# Altium schematic sheet VALVEBOARD_Controller.SchDoc
size A3; SheetNumber: 2; SheetTotal: 9
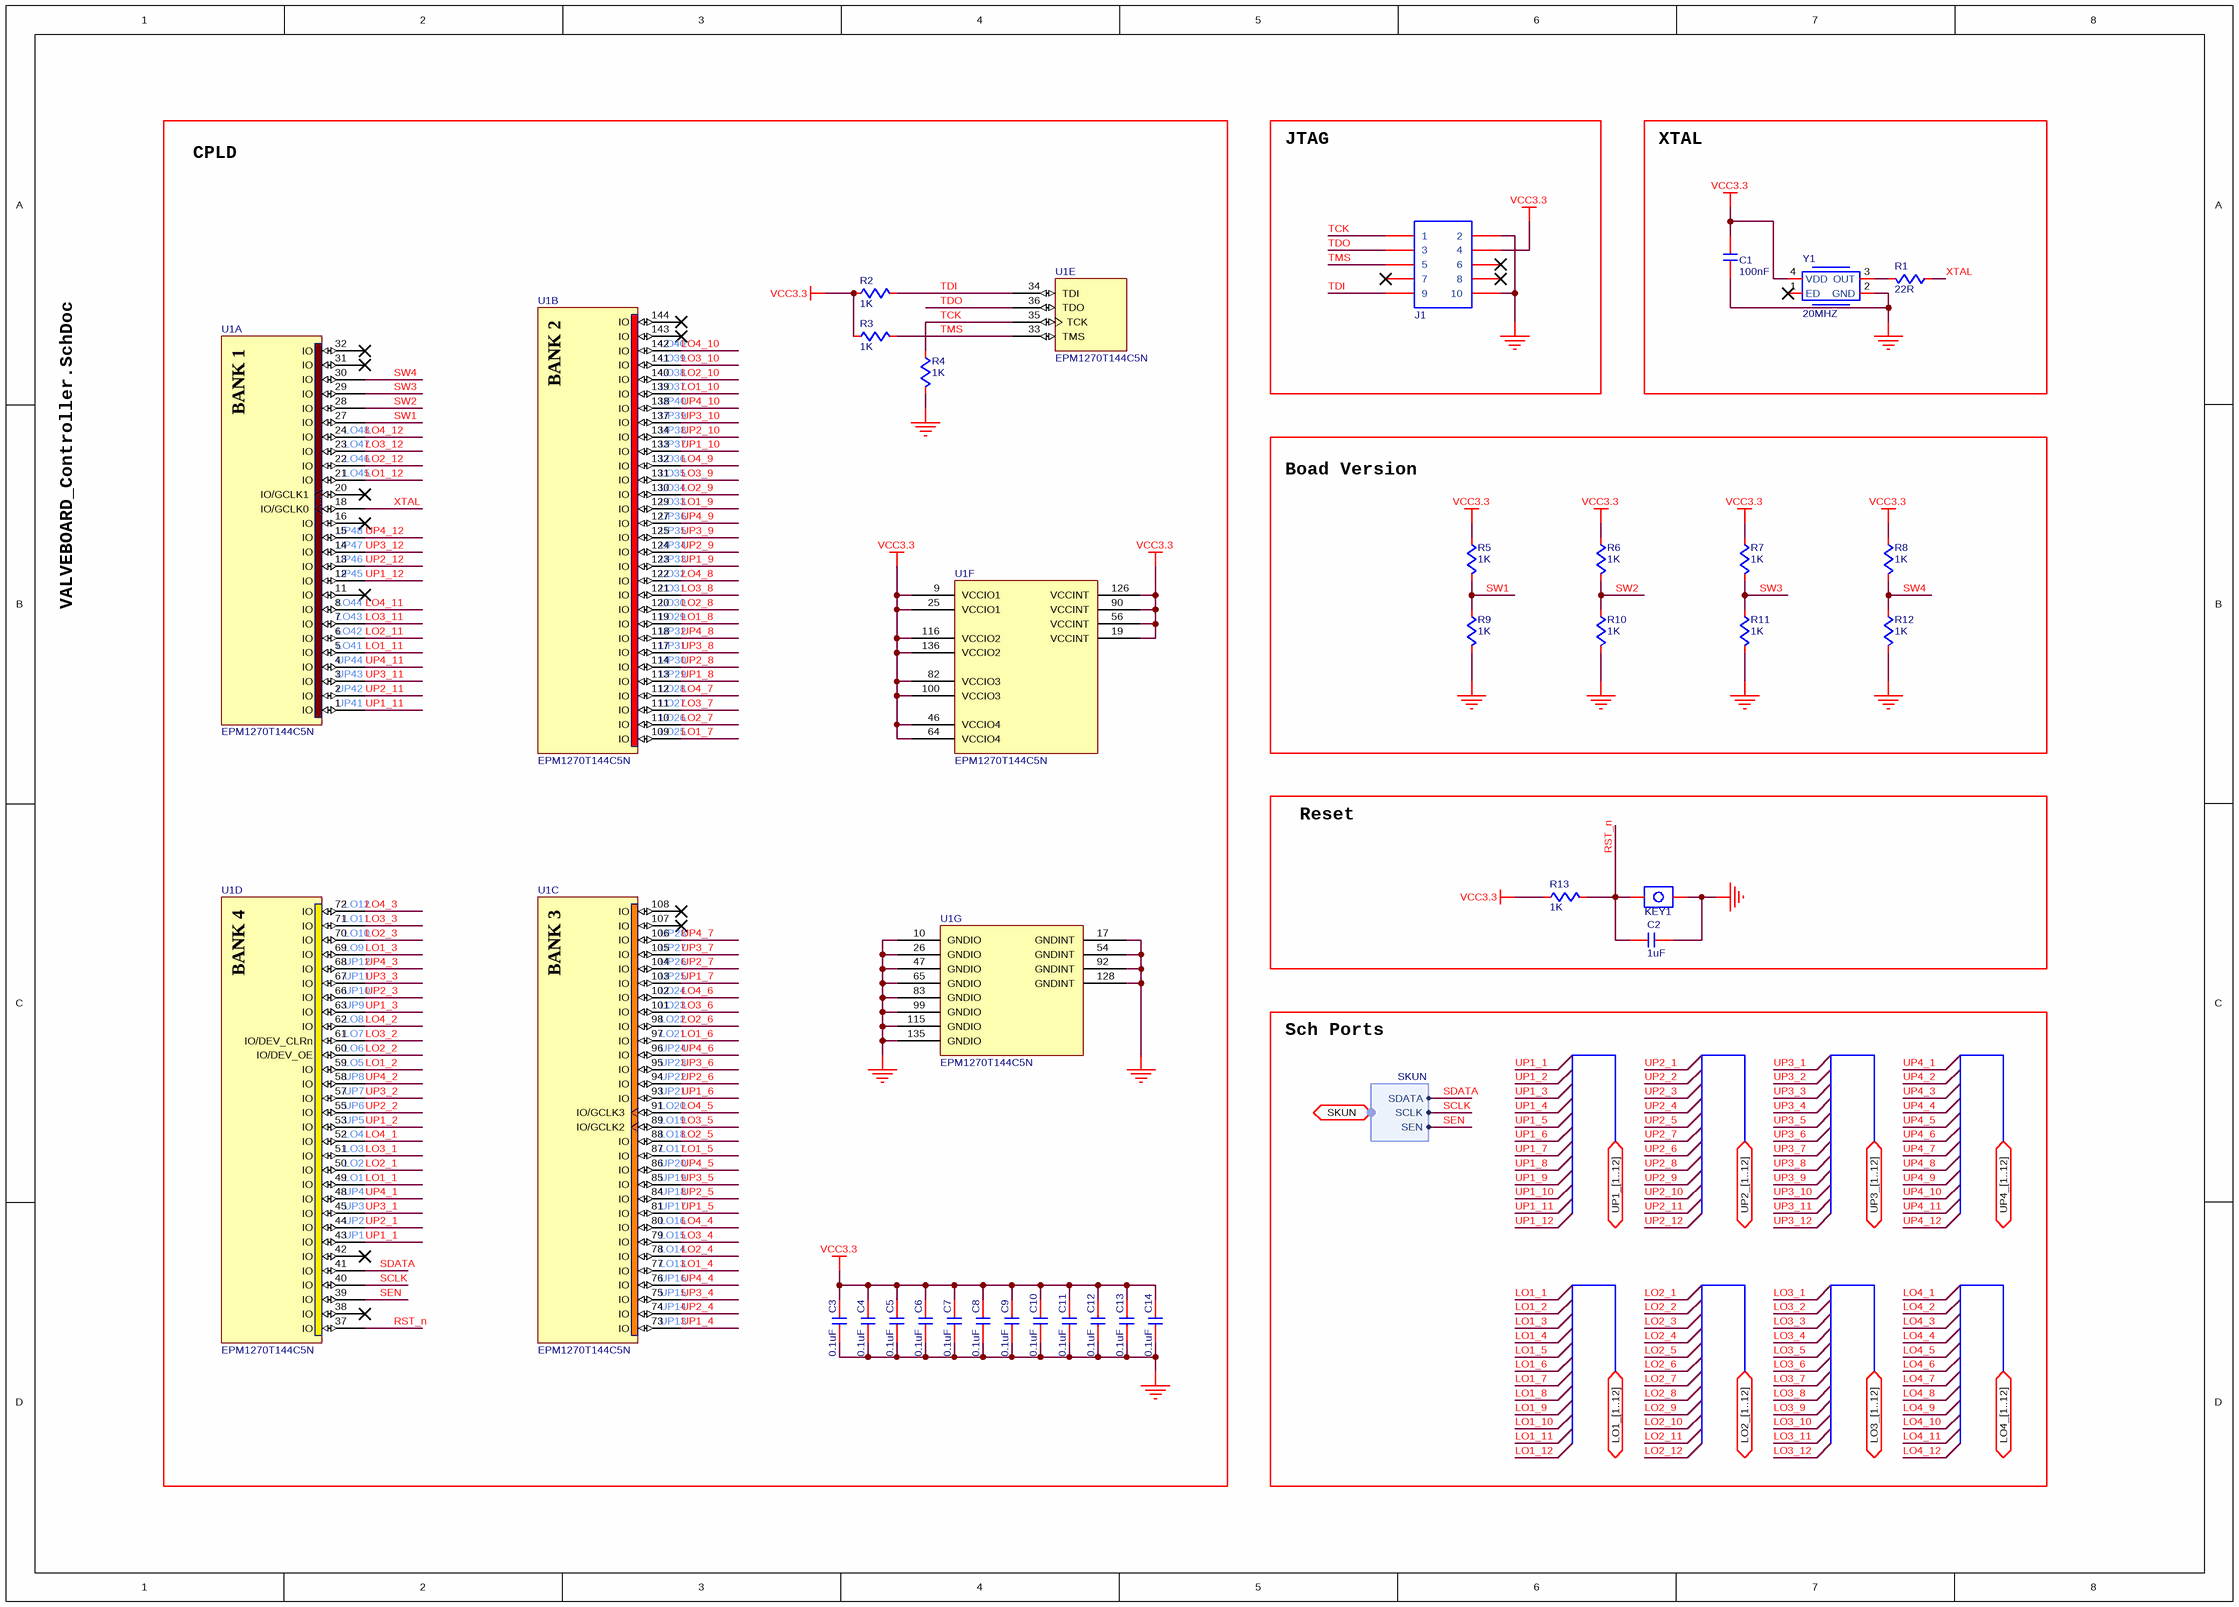
[diagram p0: VALVEBOARD_Controller.SchDoc]

## Parts
C1  value 100nF  [C0402]  (hidden comment: C-NOMO)
C2  value 1uF  [C0402]  (hidden comment: C-NOMO)
C3  value 0.1uF  [C0402]  (hidden comment: C-NOMO)
C4  value 0.1uF  [C0402]  (hidden comment: C-NOMO)
C5  value 0.1uF  [C0402]  (hidden comment: C-NOMO)
C6  value 0.1uF  [C0402]  (hidden comment: C-NOMO)
C7  value 0.1uF  [C0402]  (hidden comment: C-NOMO)
C8  value 0.1uF  [C0402]  (hidden comment: C-NOMO)
C9  value 0.1uF  [C0402]  (hidden comment: C-NOMO)
C10  value 0.1uF  [C0402]  (hidden comment: C-NOMO)
C11  value 0.1uF  [C0402]  (hidden comment: C-NOMO)
C12  value 0.1uF  [C0402]  (hidden comment: C-NOMO)
C13  value 0.1uF  [C0402]  (hidden comment: C-NOMO)
C14  value 0.1uF  [C0402]  (hidden comment: C-NOMO)
J1  HDR2X5  [HDR2X5-NJ]  (value not drawn)
KEY1  KEY  [KEY735SO]  (value not drawn)
R1  value 22R  [R0402]  (hidden comment: R)
R2  value 1K  [R0402]  (hidden comment: R)
R3  value 1K  [R0402]  (hidden comment: R)
R4  value 1K  [R0402]  (hidden comment: R)
R5  value 1K  [R0402]  (hidden comment: R)
R6  value 1K  [R0402]  (hidden comment: R)
R7  value 1K  [R0402]  (hidden comment: R)
R8  value 1K  [R0402]  (hidden comment: R)
R9  value 1K  [R0402]  (hidden comment: R)
R10  value 1K  [R0402]  (hidden comment: R)
R11  value 1K  [R0402]  (hidden comment: R)
R12  value 1K  [R0402]  (hidden comment: R)
R13  value 1K  [R0402]  (hidden comment: R)
U1  EPM1270T144C5N  [TQFP144_N]  (parts A,B,C,D,E,F,G of 7)
Y1  frequency: 20MHZ  [OSC3225]  (hidden comment: XTAL)

## Blocks framed on the sheet
CPLD: C3-C14 R2-R4 U1
JTAG: J1
XTAL: C1 R1 Y1
Boad Version: R5-R12
Reset: C2 KEY1 R13

## Ports
LO1_[1..12] (bidir), LO2_[1..12] (bidir), LO3_[1..12] (bidir), LO4_[1..12] (bidir), SKUN (bidir, harness SKUN), UP1_[1..12] (bidir), UP2_[1..12] (bidir), UP3_[1..12] (bidir), UP4_[1..12] (bidir)

## Harnesses
SKUN: SDATA, SCLK, SEN

## Nets
DGND: C1.1 C2.1 C3.1 C4.1 C5.1 C6.1 C7.1 C8.1 C9.1 C10.1 C11.1 C12.1 C13.1 C14.1 J1.2 J1.10 KEY1.1 R4.1 R9.1 R10.1 R11.1 R12.1 U1.10(GNDIO) U1.17(GNDINT) U1.26(GNDIO) U1.47(GNDIO) U1.54(GNDINT) U1.65(GNDIO) U1.83(GNDIO) U1.92(GNDINT) U1.99(GNDIO) U1.115(GNDIO) U1.128(GNDINT) U1.135(GNDIO) Y1.2(GND)
VCC3.3: C1.2 C3.2 C4.2 C5.2 C6.2 C7.2 C8.2 C9.2 C10.2 C11.2 C12.2 C13.2 C14.2 J1.4 R2.2 R3.2 R5.2 R6.2 R7.2 R8.2 R13.2 U1.9(VCCIO1) U1.19(VCCINT) U1.25(VCCIO1) U1.46(VCCIO4) U1.56(VCCINT) U1.64(VCCIO4) U1.82(VCCIO3) U1.90(VCCINT) U1.100(VCCIO3) U1.116(VCCIO2) U1.126(VCCINT) U1.136(VCCIO2) Y1.4(VDD)
LO1_1: U1.49(IO)
LO1_2: U1.59(IO)
LO1_3: U1.69(IO)
LO1_4: U1.77(IO)
LO1_5: U1.87(IO)
LO1_6: U1.97(IO)
LO1_7: U1.109(IO)
LO1_8: U1.119(IO)
LO1_9: U1.129(IO)
LO1_10: U1.139(IO)
LO1_11: U1.5(IO)
LO1_12: U1.21(IO)
LO2_1: U1.50(IO)
LO2_2: U1.60(IO/DEV_OE)
LO2_3: U1.70(IO)
LO2_4: U1.78(IO)
LO2_5: U1.88(IO)
LO2_6: U1.98(IO)
LO2_7: U1.110(IO)
LO2_8: U1.120(IO)
LO2_9: U1.130(IO)
LO2_10: U1.140(IO)
LO2_11: U1.6(IO)
LO2_12: U1.22(IO)
LO3_1: U1.51(IO)
LO3_2: U1.61(IO/DEV_CLRn)
LO3_3: U1.71(IO)
LO3_4: U1.79(IO)
LO3_5: U1.89(IO/GCLK2)
LO3_6: U1.101(IO)
LO3_7: U1.111(IO)
LO3_8: U1.121(IO)
LO3_9: U1.131(IO)
LO3_10: U1.141(IO)
LO3_11: U1.7(IO)
LO3_12: U1.23(IO)
LO4_1: U1.52(IO)
LO4_2: U1.62(IO)
LO4_3: U1.72(IO)
LO4_4: U1.80(IO)
LO4_5: U1.91(IO/GCLK3)
LO4_6: U1.102(IO)
LO4_7: U1.112(IO)
LO4_8: U1.122(IO)
LO4_9: U1.132(IO)
LO4_10: U1.142(IO)
LO4_11: U1.8(IO)
LO4_12: U1.24(IO)
RST_n: C2.2 KEY1.2 R13.1 U1.37(IO)
SCLK: U1.40(IO) ; port SKUN.SCLK
SDATA: U1.41(IO) ; port SKUN.SDATA
SEN: U1.39(IO) ; port SKUN.SEN
SW1: R5.1 R9.2 U1.27(IO)
SW2: R6.1 R10.2 U1.28(IO)
SW3: R7.1 R11.2 U1.29(IO)
SW4: R8.1 R12.2 U1.30(IO)
TCK: J1.1 R4.2 U1.35(TCK)
TDI: J1.9 R2.1 U1.34(TDI)
TDO: J1.3 U1.36(TDO)
TMS: J1.5 R3.1 U1.33(TMS)
UP1_1: U1.43(IO)
UP1_2: U1.53(IO)
UP1_3: U1.63(IO)
UP1_4: U1.73(IO)
UP1_5: U1.81(IO)
UP1_6: U1.93(IO)
UP1_7: U1.103(IO)
UP1_8: U1.113(IO)
UP1_9: U1.123(IO)
UP1_10: U1.133(IO)
UP1_11: U1.1(IO)
UP1_12: U1.12(IO)
UP2_1: U1.44(IO)
UP2_2: U1.55(IO)
UP2_3: U1.66(IO)
UP2_4: U1.74(IO)
UP2_5: U1.84(IO)
UP2_6: U1.94(IO)
UP2_7: U1.104(IO)
UP2_8: U1.114(IO)
UP2_9: U1.124(IO)
UP2_10: U1.134(IO)
UP2_11: U1.2(IO)
UP2_12: U1.13(IO)
UP3_1: U1.45(IO)
UP3_2: U1.57(IO)
UP3_3: U1.67(IO)
UP3_4: U1.75(IO)
UP3_5: U1.85(IO)
UP3_6: U1.95(IO)
UP3_7: U1.105(IO)
UP3_8: U1.117(IO)
UP3_9: U1.125(IO)
UP3_10: U1.137(IO)
UP3_11: U1.3(IO)
UP3_12: U1.14(IO)
UP4_1: U1.48(IO)
UP4_2: U1.58(IO)
UP4_3: U1.68(IO)
UP4_4: U1.76(IO)
UP4_5: U1.86(IO)
UP4_6: U1.96(IO)
UP4_7: U1.106(IO)
UP4_8: U1.118(IO)
UP4_9: U1.127(IO)
UP4_10: U1.138(IO)
UP4_11: U1.4(IO)
UP4_12: U1.15(IO)
XTAL: R1.2 U1.18(IO/GCLK0)
NetR1_1: R1.1 Y1.3(OUT)

Not connected (* = marked no-connect by the designer): J1 6* 7* 8*; U1 11(IO)* 16(IO)* 20(IO/GCLK1)* 31(IO)* 32(IO)* 38(IO)* 42(IO)* 107(IO)* 108(IO)* 143(IO)* 144(IO)*; Y1 1(ED)*

## Notes on the sheet
- (near U1) UP40
- (near U1) LO37
- (near U1) LO38
- (near U1) LO39
- (near U1) LO40
- (near U1) LO45
- (near U1) LO46
- (near U1) LO47
- (near U1) LO48
- (near U1) UP37
- (near U1) UP38
- (near U1) UP39
- (near U1) LO35
- (near U1) LO36
- (near U1) UP47
- (near U1) UP48
- (near U1) UP34
- (near U1) UP35
- (near U1) UP36
- (near U1) LO33
- (near U1) LO34
- (near U1) UP45
- (near U1) UP46
- (near U1) LO43
- (near U1) LO44
- (near U1) UP33
- (near U1) LO29
- (near U1) LO30
- (near U1) LO31
- (near U1) LO32
- (near U1) UP42
- (near U1) UP43
- (near U1) UP44
- (near U1) LO41
- (near U1) LO42
- (near U1) UP29
- (near U1) UP30
- (near U1) UP31
- (near U1) UP32
- (near U1) LO28
- (near U1) UP41
- (near U1) LO25
- (near U1) LO26
- (near U1) LO27
- (near U1) LO12
- (near U1) UP11
- (near U1) UP12
- (near U1) LO9
- (near U1) LO10
- (near U1) LO11
- (near U1) UP25
- (near U1) UP26
- (near U1) UP27
- (near U1) UP28
- (near U1) UP9
- (near U1) UP10
- (near U1) LO6
- (near U1) LO7
- (near U1) LO8
- (near U1) UP24
- (near U1) LO21
- (near U1) LO22
- (near U1) LO23
- (near U1) LO24
- Sch Ports
- (near U1) UP5
- (near U1) UP6
- (near U1) UP7
- (near U1) UP8
- (near U1) LO5
- (near U1) UP21
- (near U1) UP22
- (near U1) UP23
- (near U1) LO19
- (near U1) LO20
- (near U1) UP4
- (near U1) LO1
- (near U1) LO2
- (near U1) LO3
- (near U1) LO4
- (near U1) UP18
- (near U1) UP19
- (near U1) UP20
- (near U1) LO17
- (near U1) LO18
- (near U1) UP1
- (near U1) UP2
- (near U1) UP3
- (near U1) UP17
- (near U1) LO13
- (near U1) LO14
- (near U1) LO15
- (near U1) LO16
- (near U1) UP13
- (near U1) UP14
- (near U1) UP15
- (near U1) UP16
- (in symbol EPM1270T144C5N, part A) BANK 1
- (in symbol EPM1270T144C5N, part B) BANK 2
- (in symbol EPM1270T144C5N, part C) BANK 3
- (in symbol EPM1270T144C5N, part D) BANK 4

## Library data of the parts
C1-C14 = C-NOMO: voltage: 25V; precision: 5%
R1-R13 = R: precision: 1%
U1 = EPM1270T144C5N: MAX II 3.3/2.5V CPLD, 116 IOs, 1,270 Logic Elements, 144-Pin Plastic TQFP, Commercial Temperature, Speed Grade 5, Pb-Free; Note: All VCCINT pins must be connected to either 3.3V or 2.5V (but not a combination of both).; DatasheetVersion: ver1.8, Jul-2006; PackageVersion: ver16.3, Dec-2010; PackageReference: TQFP144; PackageDescription: 144-Pin Plastic Thin Quad Flat Pack (TQFP144) - Wire Bond; Code_JEDEC: MS-026-BFB; ComponentLink1Description: Manufacturer URL; ComponentLink1URL: http://www.altera.com/; ComponentLink2Description: Handbook; ComponentLink2URL: http://www.altera.com/literature/hb/max2/max2_mii5v1.pdf; ComponentLink3Description: Package Specification; ComponentLink3URL: http://www.altera.com/literature/ds/dspkg.pdf